# Altium project relay_ac.PrjPcb
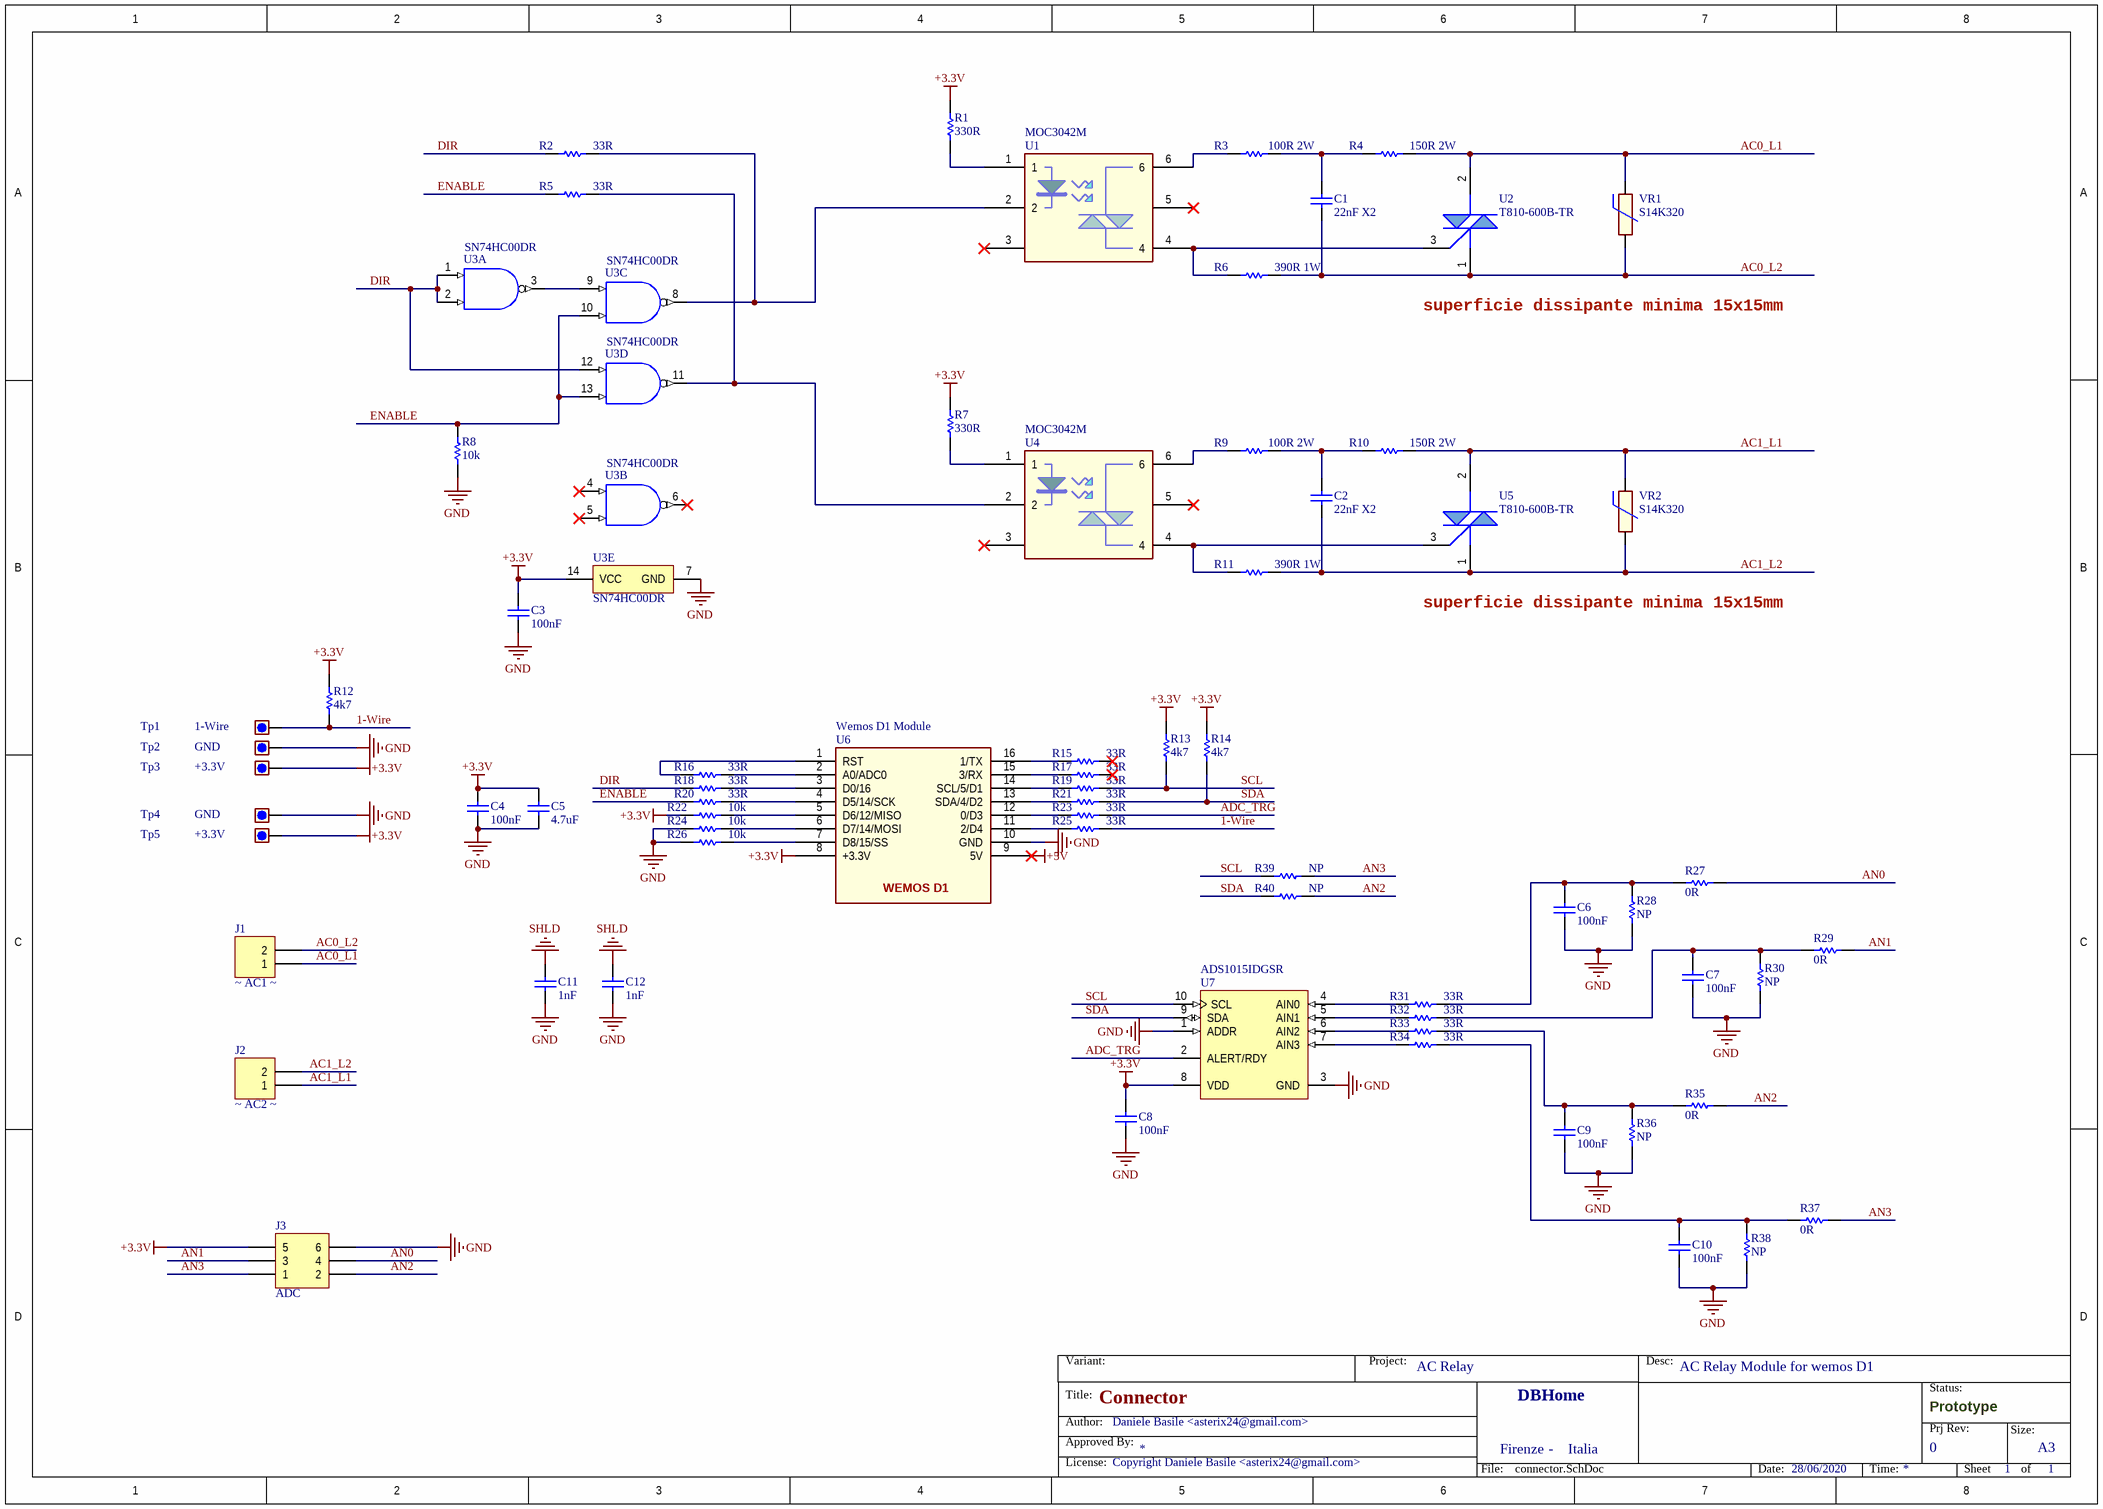
[diagram p0: connector.SchDoc]
pcb_finish: HASL; pcb_layer_count: 2; pcb_material: FR4-Standard Tg 130-140C; pcb_silkscreen_color: WHITE; pcb_solder_color: BLUE; pcb_stackup: Default; prj_customer: DBHome; prj_date: 28/06/2020; prj_hw_ver: 0; prj_license: Copyright Daniele Basile <asterix24@gmail.com>; prj_name: AC Relay; prj_name_long: AC Relay Module for wemos D1; prj_panel_name: relay_ac_panel; prj_pcb: A; prj_pn: -; prj_status: Prototype
1 sheet, 69 parts. Net scope: hierarchical (ports join the sheet entries above them; power ports are global).
Board files: realy_ac_panel.PcbDoc, relay_ac.PcbDoc

## Sheet connector.SchDoc: Connector
size A3; Author: Daniele Basile <asterix24@gmail.com>; Organization: DBHome; Address3: Firenze; Address4: Italia; Revision: A; SheetNumber: 1; SheetTotal: 1; Hw_rev: R1

### Parts
C1  22nF X2  [RADIAL-10MM]
C2  22nF X2  [RADIAL-10MM]
C3  100nF  [0402_[1005]]
C4  100nF  [0402_[1005]]
C5  4.7uF  [0805_[2012]]
C6  100nF  [0402_[1005]]
C7  100nF  [0402_[1005]]
C8  100nF  [0402_[1005]]
C9  100nF  [0402_[1005]]
C10  100nF  [0402_[1005]]
C11  1nF  [0603_[1608]]
C12  1nF  [0603_[1608]]
J1  ~ AC1 ~  [CON_WIRE_SCREW_2x1_5MM_THD]
J2  ~ AC2 ~  [CON_WIRE_SCREW_2x1_5MM_THD]
J3  ADC  [CON_6P_WAGO_3.5mm]
R1  330R  [0402_[1005]]
R2  33R  [0402_[1005]]
R3  100R 2W  [2512_[6432]]
R4  150R 2W  [2512_[6432]]
R5  33R  [0402_[1005]]
R6  390R 1W  [2512_[6432]]
R7  330R  [0402_[1005]]
R8  10k  [0402_[1005]]
R9  100R 2W  [2512_[6432]]
R10  150R 2W  [2512_[6432]]
R11  390R 1W  [2512_[6432]]
R12  4k7  [0402_[1005]]
R13  4k7  [0402_[1005]]
R14  4k7  [0402_[1005]]
R15  33R  [0402_[1005]]
R16  33R  [0402_[1005]]
R17  33R  [0402_[1005]]
R18  33R  [0402_[1005]]
R19  33R  [0402_[1005]]
R20  33R  [0402_[1005]]
R21  33R  [0402_[1005]]
R22  10k  [0402_[1005]]
R23  33R  [0402_[1005]]
R24  10k  [0402_[1005]]
R25  33R  [0402_[1005]]
R26  10k  [0402_[1005]]
R27  0R  [0402_[1005]]
R28  NP  [0402_[1005]]
R29  0R  [0402_[1005]]
R30  NP  [0402_[1005]]
R31  33R  [0402_[1005]]
R32  33R  [0402_[1005]]
R33  33R  [0402_[1005]]
R34  33R  [0402_[1005]]
R35  0R  [0402_[1005]]
R36  NP  [0402_[1005]]
R37  0R  [0402_[1005]]
R38  NP  [0402_[1005]]
R39  NP  [0402_[1005]]
R40  NP  [0402_[1005]]
Tp1  1-Wire  [TEST_POINT_SMD_R5x3MM]  (no BOM)
Tp2  GND  [TEST_POINT_SMD_R5x3MM]  (no BOM)
Tp3  +3.3V  [TEST_POINT_SMD_R5x3MM]  (no BOM)
Tp4  GND  [TEST_POINT_SMD_R5x3MM]  (no BOM)
Tp5  +3.3V  [TEST_POINT_SMD_R5x3MM]  (no BOM)
U1  MOC3042M  [SOIC6_OPTO]
U2  T810-600B-TR  [TO-252_D2PAK_LARGEPAD]
U3  SN74HC00DR  [SOIC14]  (parts A,B,C,D,E of 5)
U4  MOC3042M  [SOIC6_OPTO]
U5  T810-600B-TR  [TO-252_D2PAK_LARGEPAD]
U6  Wemos D1 Module  [WEMOS_D1]
U7  ADS1015IDGSR  [MSOP50P490X110-10P]
VR1  S14K320  [VAR_DISC_7.5MM_THD]
VR2  S14K320  [VAR_DISC_7.5MM_THD]

### Nets
+3.3V: C3.2 C4.2 C5.2 C8.2 J3.5 R1.2 R7.2 R12.2 R13.2 R14.2 R22.2 Tp3.1 Tp5.1 U3.14(VCC) U6.8(+3.3V) U7.8(VDD)
+5V: U6.9(5V)
GND: C3.1 C4.1 C5.1 C6.1 C7.1 C8.1 C9.1 C10.1 C11.1 C12.1 J3.6 R8.2 R24.2 R26.2 R28.2 R30.2 R36.2 R38.2 Tp2.1 Tp4.1 U3.7(GND) U6.10(GND) U7.1(ADDR) U7.3(GND)
SHLD: C11.2 C12.2
1-Wire: R12.1 R25.1 Tp1.1
AC0_L1: J1.1 R4.1 U2.2 VR1.2
AC0_L2: C1.1 J1.2 R6.1 U2.1 VR1.1
AC1_L1: J2.1 R10.1 U5.2 VR2.2
AC1_L2: C2.1 J2.2 R11.1 U5.1 VR2.1
ADC_TRG: R23.1 U7.2(ALERT/RDY)
AN0: J3.4 R27.2
AN1: J3.3 R29.2
AN2: J3.2 R35.2 R40.2
AN3: J3.1 R37.2 R39.2
DIR: R2.2 R18.2 U3.1(1A) U3.2(1B) U3.12(4A)
ENABLE: R5.2 R8.1 R20.2 U3.10(3B) U3.13(4B)
SCL: R13.1 R19.1 R39.1 U7.10(SCL)
SDA: R14.1 R21.1 R40.1 U7.9(SDA)
NetC1_2: C1.2 R3.1 R4.2
NetC2_2: C2.2 R9.1 R10.2
NetC6_2: C6.2 R27.1 R28.1 R31.1
NetC7_2: C7.2 R29.1 R30.1 R32.1
NetC9_2: C9.2 R33.1 R35.1 R36.1
NetC10_2: C10.2 R34.1 R37.1 R38.1
NetR1_1: R1.1 U1.1
NetR2_1: R2.1 U1.2 U3.8(3Y)
NetR3_2: R3.2 U1.6
NetR5_1: R5.1 U3.11(4Y) U4.2
NetR6_2: R6.2 U1.4 U2.3
NetR7_1: R7.1 U4.1
NetR9_2: R9.2 U4.6
NetR11_2: R11.2 U4.4 U5.3
NetR15_2: R15.2 U6.16(1/TX)
NetR16_1: R16.1 U6.2(A0/ADC0)
NetR16_2: R16.2 U6.1(RST)
NetR17_2: R17.2 U6.15(3/RX)
NetR18_1: R18.1 U6.3(D0/16)
NetR19_2: R19.2 U6.14(SCL/5/D1)
NetR20_1: R20.1 U6.4(D5/14/SCK)
NetR21_2: R21.2 U6.13(SDA/4/D2)
NetR22_1: R22.1 U6.5(D6/12/MISO)
NetR23_2: R23.2 U6.12(0/D3)
NetR24_1: R24.1 U6.6(D7/14/MOSI)
NetR25_2: R25.2 U6.11(2/D4)
NetR26_1: R26.1 U6.7(D8/15/SS)
NetR31_2: R31.2 U7.4(AIN0)
NetR32_2: R32.2 U7.5(AIN1)
NetR33_2: R33.2 U7.6(AIN2)
NetR34_2: R34.2 U7.7(AIN3)
NetU3_3: U3.3(1Y) U3.9(3A)

Not connected (* = marked no-connect by the designer): R15 1*; R17 1*; U1 3* 5*; U3 4(2A)* 5(2B)* 6(2Y)*; U4 3* 5*

### Notes on the sheet
- superficie dissipante minima 15x15mm
- Title:
- Variant:
- Project:
- Desc:
- Status:
- Author:
- Approved By:
- -
- Prj Rev:
- Size:
- A3
- License:
- File:
- Date:
- Time:
- Sheet
- of

### Library data of the parts
C1 C2 = Cap: Capacitor X2 275V; Value: 22nF X2; NOTE Manufacturer PN: *; NOTE Manufacturer: *; MountTechnology: PTH; CODE Develer: *; ComponentLink1Description: New link; ComponentLink1URL: *; NOTE Description: *; NOTE Description 2: *
C3-C12 = Cap: Capacitor; NOTE Manufacturer PN: *; NOTE Manufacturer: *; MountTechnology: *; CODE Develer: *; ComponentLink1Description: New link; ComponentLink1URL: *; NOTE Description: *; NOTE Description 2: *
  C3 C4 C6-C10: Value: 100nF
  C5: Value: 4.7uF
  C11 C12: Value: 1nF
J1 J2 = Header 2: Header, 2-Pin; LatestRevisionDate: 17-Jul-2002; LatestRevisionNote: Re-released for DXP Platform.; Publisher: Altium Limited
J3 = Header 3X2: Header, 3-Pin, Dual row; LatestRevisionDate: 17-Jul-2002; LatestRevisionNote: Re-released for DXP Platform.; Publisher: Altium Limited
R1 R2 R5 R7 R8 R12-R40 = Res1: Resistor; Publisher: Develer srl; Revision: 0.1; NOTE Manufacturer PN: *; NOTE Manufacturer: *; MountTechnology: SMT; CODE Develer: *; NOTE Description: *; NOTE Description 2: *
R3 R9 = Res1: Resistor 300V (Walsin WF25P271); Publisher: Develer srl; Revision: 0.1; NOTE Manufacturer PN: *; NOTE Manufacturer: *; MountTechnology: SMT; CODE Develer: *; NOTE Description: *; NOTE Description 2: *
R4 R10 = Res1: Resistor 2W 300V (Walsin WF25P471); Publisher: Develer srl; Revision: 0.1; NOTE Manufacturer PN: *; NOTE Manufacturer: *; MountTechnology: SMT; CODE Develer: *; NOTE Description: *; NOTE Description 2: *
R6 R11 = Res1: Resistor 1W 200V; Publisher: Develer srl; Revision: 0.1; NOTE Manufacturer PN: *; NOTE Manufacturer: *; MountTechnology: SMT; CODE Develer: *; NOTE Description: *; NOTE Description 2: *
Tp1-Tp5 = Test_point
U1 U4 = MOC302xS: Opto-triac; Publisher: Develer srl; Revision: 0.1; NOTE Manufacturer PN: *; NOTE Manufacturer: *; MountTechnology: SMT; CODE Develer: *; NOTE Description: *; NOTE Description 2: *
U2 U5 = triac: Publisher: Develer srl; Revision: 0.1; NOTE Manufacturer PN: *; NOTE Manufacturer: *; MountTechnology: SMT; CODE Develer: *; NOTE Description: *; NOTE Description 2: *
U3 = TI-NAND-4-2IN-14_G: Quad 2-Input Positive-NAND Gates, D0014A, LARGE T&R; Manufacturer: Texas Instruments; VCC(Max)(V): 6; Technology Family: HC; Schmitt Trigger: Yes; ICC @ Nom Voltage(Max)(mA): 0.02; F @ Nom Voltage(Max)(Mhz): 70; Bits(#): 4; Input Type: CMOS; Output Drive (IOL/IOH)(Max)(mA): 5.2/-5.2; Voltage(Nom)(V): 5; VCC(Min)(V): 2; Rating: Catalog; tpd @ Nom Voltage(Max)(ns): 23; Generic Part Number: SN74HC00; Code_JEDEC: MS-012; PackageReference: D0014A; DatasheetVersion: SCLS181E; Operating Temperature Range(C): -40 to 85; Output Type: CMOS
U6 = WEMOS D1: ComponetDescritions (altrenative1; alternativ2); Publisher: Develer srl; Revision: 0.1; NOTE Manufacturer PN: *; NOTE Manufacturer: *; MountTechnology: SMT; CODE Develer: *; NOTE Description: *; NOTE Description 2: *
U7 = TI-ADS1015_1115-10: 12-Bit ADC with Integrated Multiplexer, PGA, Comparator, Oscillator, and Reference, -40 to 125 degC, 10-pin SOP (DGS10), Green (RoHS & no Sb/Br); Manufacturer: Texas Instruments; # Input Channels: 4; Digital Supply(Max)(V): 5.5; Resolution(Bits): 12; Digital Supply(Min)(V): 2; Architecture: Delta-Sigma; Sample Rate (max)(SPS): 3.3k; SubFamily: Precision ADC (<=10MSPS); INL(Max)(+/-LSB): 0.5; Interface: Serial I2C; ComponentLink1Description: Manufacturer URL; PartNumber: ADS1015IDGSR; PackageDescription: 10-Pin Plastic Small Outline, Body 3 x 3 mm, Pitch 0.5 mm; PackageVersion: 4073272/C, 02/2004; ComponentLink3URL: http://www.ti.com/lit/ml/mpds035b/mpds035b.pdf; Eco-Plan: Green (RoHS & no Sb/Br); ComponentLink2URL: http://www.ti.com/general/docs/lit/getliterature.tsp?genericPartNumber=ADS1015&fileType=pdf; Mounting Technology: Surface Mount; ComponentLink1URL: http://www.ti.com/; DatasheetVersion: SBAS473C; Analog Voltage AV/DD(Min)(V): 2; ComponentLink2Description: Datasheet; Code_JEDEC: MO-153; Analog Voltage AV/DD(Max)(V): 5.5; PackageReference: DGS10; ComponentLink3Description: Package Specification
VR1 VR2 = VARISTOR: ComponetDescritions (altrenative1; alternativ2); Publisher: Develer srl; Revision: 0.1; NOTE Manufacturer PN: *; NOTE Manufacturer: *; MountTechnology: PTH; CODE Develer: *; NOTE Description: *; NOTE Description 2: *